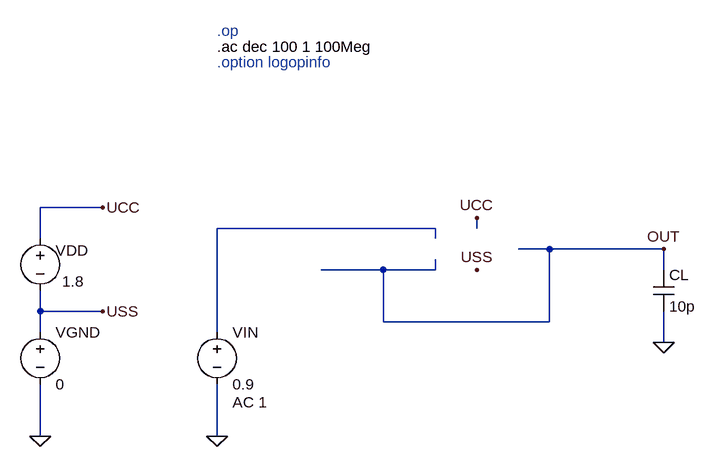
[diagram p0: schematic simAC.asc]
simAC.asc, the LTspice schematic file:
Version 4
SHEET 1 1660 680
WIRE -176 64 -272 64
WIRE 336 96 0 96
WIRE 400 96 400 80
WIRE -272 112 -272 64
WIRE 336 112 336 96
WIRE 512 128 464 128
WIRE 688 128 512 128
WIRE 256 160 160 160
WIRE 336 160 336 144
WIRE 336 160 256 160
WIRE 688 160 688 128
WIRE -272 224 -272 192
WIRE -176 224 -272 224
WIRE 256 240 256 160
WIRE 512 240 512 128
WIRE 512 240 256 240
WIRE -272 256 -272 224
WIRE 0 256 0 96
WIRE 688 272 688 224
WIRE -272 416 -272 336
WIRE 0 416 0 336
FLAG -272 416 0
FLAG -176 64 UCC
FLAG -176 224 USS
FLAG 0 416 0
FLAG 688 272 0
FLAG 688 128 OUT
FLAG 400 80 UCC
FLAG 400 160 USS
DATAFLAG -256 64 "round(I(VDD)*1e7)/1e7"
DATAFLAG 208 160 ""
DATAFLAG 144 96 ""
DATAFLAG 544 128 ""
SYMBOL voltage -272 96 R0
WINDOW 0 24 34 Left 2
WINDOW 3 34 82 Left 2
SYMATTR InstName VDD
SYMATTR Value 1.8
SYMBOL voltage -272 240 R0
SYMATTR InstName VGND
SYMATTR Value 0
SYMBOL voltage 0 240 R0
WINDOW 123 24 124 Left 2
WINDOW 39 0 0 Left 0
SYMATTR Value2 AC 1
SYMATTR InstName VIN
SYMATTR Value 0.9
SYMBOL cap 672 160 R0
SYMATTR InstName CL
SYMATTR Value 10p
TEXT 0 -184 Left 2 !.ac dec 100 1 100Meg
TEXT 0 -160 Left 2 ;.option logopinfo
TEXT 0 -208 Left 2 ;.op

The netlist it stands for:
* simAC.asc
VDD UCC USS 1.8
VGND USS 0 0
VIN N001 0 0.9 AC 1
CL OUT 0 10p
.ac dec 100 1 100Meg
* .option logopinfo
* .op
.backanno
.end